# Altium schematic sheet Vertap_Connectors.SchDoc: Connectors
size A4; Author: Taim Al-Dabbagh; DrawnBy: Taim Al-Dabbagh; Revision: v1; SheetNumber: 5; SheetTotal: 6
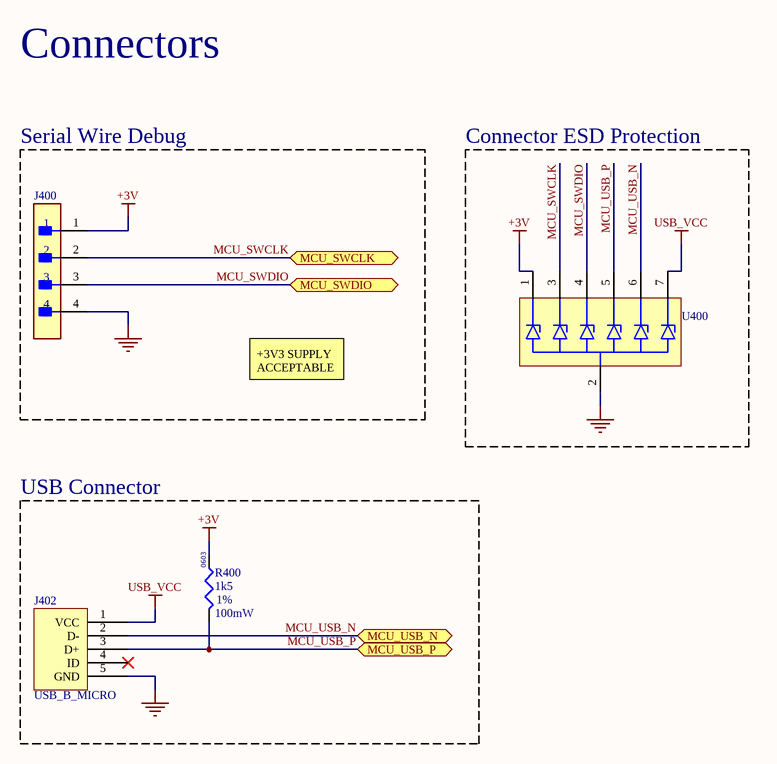
[diagram p0: Vertap_Connectors.SchDoc]

## Parts
J400  GEC04SBSN-M89  [FP-GEC04SBSN-M89-MFG]  (value not drawn)
J402  USB_B_MICRO  [MUSB-B5-S-RA-SMT-PP-T/R]
R400  1k5  [RES_0603_YAGEO]
U400  PUSB3FR6Z  [PUSB3FR6Z]  (value not drawn)

## Blocks framed on the sheet
Serial Wire Debug: J400
Connector ESD Protection: U400
USB Connector: J402 R400

## Ports
MCU_SWCLK (bidir), MCU_SWDIO (bidir), MCU_USB_N (bidir), MCU_USB_P (bidir)

## Nets
+3V: J400.1 R400.1 U400.1
GND: J400.4 J402.5(GND) U400.2(GND)
USB_VCC: J402.1(VCC) U400.7
MCU_SWCLK: J400.2 U400.3 ; port MCU_SWCLK
MCU_SWDIO: J400.3 U400.4 ; port MCU_SWDIO
MCU_USB_N: J402.2(D-) U400.6 ; port MCU_USB_N
MCU_USB_P: J402.3(D+) R400.2 U400.5 ; port MCU_USB_P

Not connected (* = marked no-connect by the designer): J402 4(ID)*

## Notes on the sheet
- Connectors
- +3V3 SUPPLY ACCEPTABLE
- (near R400) 0603
- (near R400) 100mW
- (near R400) 1%

## Library data of the parts
J400 = CMP-25680-000072-1: CONN HEADER SMD R/A 4POS 2.54MM; Number of Contacts: 4; Pitch: 0.1inch; Gender: Male; Connector Type: Male Pin; Termination: Solder; Flammability Rating: UL94 V-0; Insulation Material: Nylon; Lead Free: Lead Free; Contact Mating Length: 0.23inch; Housing Material: Plastic; Contact Plating: Tin; Package Quantity: 1; Contact Finish - Mating: TIN; Series: -; Length: 10.2mm; Insulation Color: Black; Number of Positions: 4; Min Operating Temperature: -65°C; Height: 3.56mm; Housing Color: Black; Width: 2.54mm; Max Operating Temperature: 150°C; Mount: Surface Mount; RoHS Compliant: Yes; Contact Type: Male Pin; Contact Material: Bronze; Packaging: Bulk; Number of Rows: 1; Contact Shape: Square; Color: Black; Fastening Type: Pull
J402 = MUSB-B5-S-RA-SMT-PP-T/R: MINI USB, TYPE B, RIGHT ANGLE, S; Supplier 1: Arrow Electronics; Supplier Part Number 1: MUSB-B5-S-RA-SMT-PP-T/R
R400 = RES_0603_1.5K: RES 1.5K OHM 1% 1/10W 0603; Manufacturer: YAGEO; Manufacturer Part Number: RC0603FR-131K5L; Supplier 1: Future Electronics; Supplier Part Number 1: 7064402
U400 = PUSB3FR6Z: TVS DIODE 3.3VWM 3VC 7XSON; Supplier 1: Arrow Electronics; Supplier Part Number 1: PUSB3FR6Z